# EAGLE design drive_board (EAGLE 8.4.0)
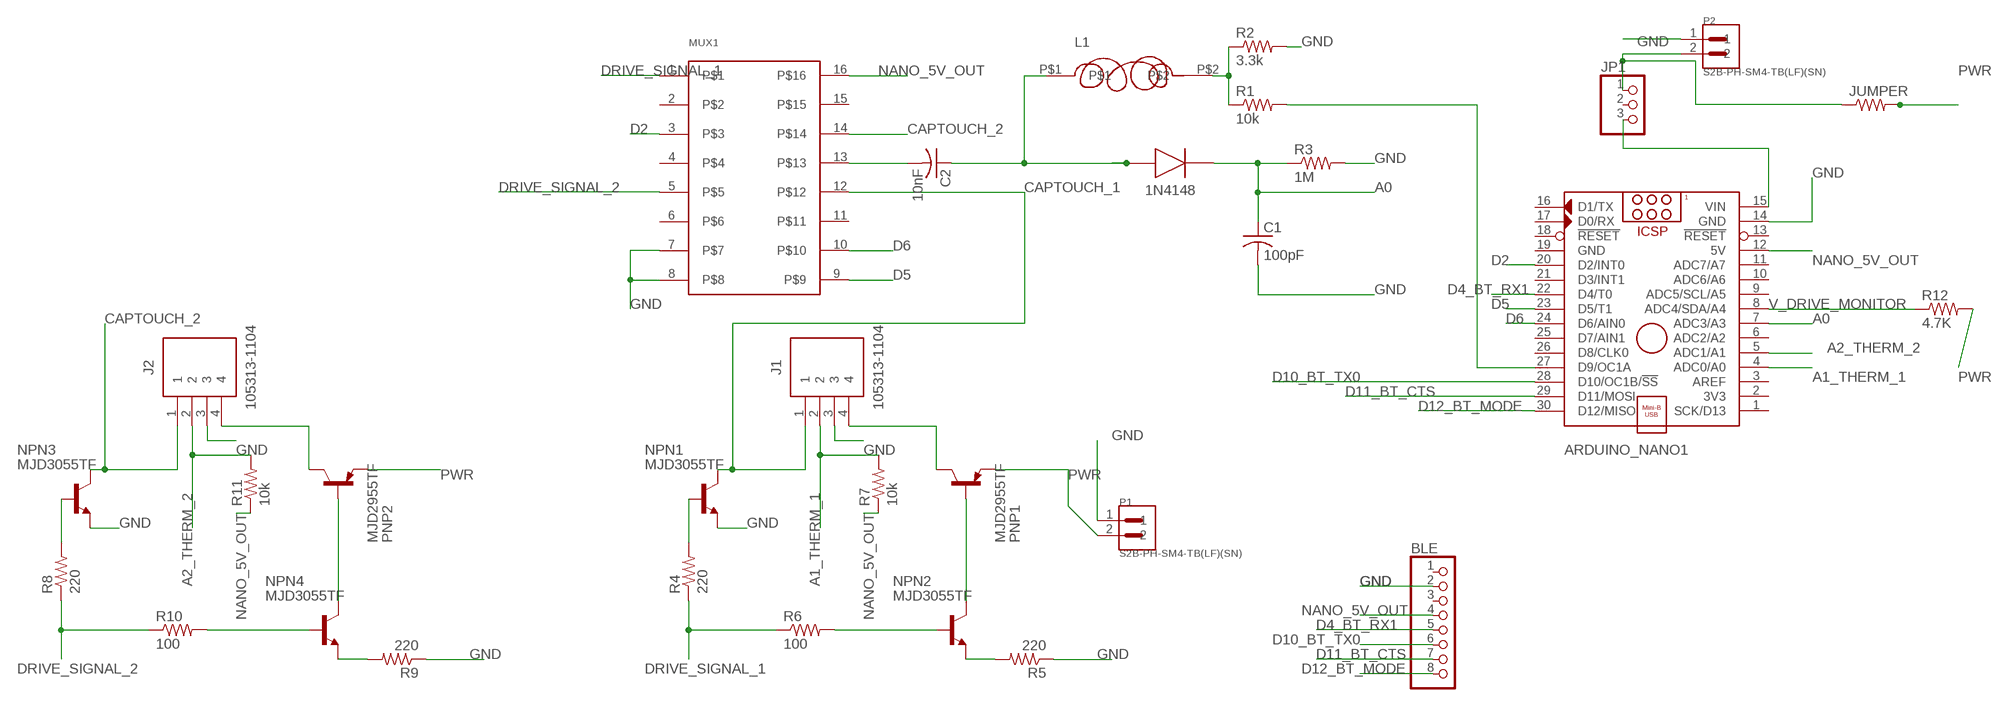
[diagram p0: schematic, sheet 1]

## Parts
1N4148  1N5819HW-7-F  [SOD3716X145N]
ARDUINO_NANO1  ARDUINO_NANO  [ARDUINO_NANO]
BLE  PINHD-1X8  [1X08]
C1  100pF  C-USC0805  [C0805]
C2  10nF  C-USC0805  [C0805]
J1  105313-1104  [105313-1104]
J2  105313-1104  [105313-1104]
JP1  PINHD-1X3  [1X03]
JUMPER  R-US_R0805  [R0805]
L1  SRE6603  [SRE6603]
MUX1  HAIRIO_MUX  [SO16]
NPN1  MJD3055TF  MJD31  [DPAK]
NPN2  MJD3055TF  MJD31  [DPAK]
NPN3  MJD3055TF  MJD31  [DPAK]
NPN4  MJD3055TF  MJD31  [DPAK]
P1  S2B-PH-SM4-TB(LF)(SN)  [JST_S2B-PH-SM4-TB(LF)(SN)]
P2  S2B-PH-SM4-TB(LF)(SN)  [JST_S2B-PH-SM4-TB(LF)(SN)]
PNP1  MJD2955TF  MJD32  [DPAK]
PNP2  MJD2955TF  MJD32  [DPAK]
R1  10k  R-US_R0805  [R0805]
R2  3.3k  R-US_R0805  [R0805]
R3  1M  R-US_R0805  [R0805]
R4  220  R-US_R0805  [R0805]
R5  220  R-US_R0805  [R0805]
R6  100  R-US_R0805  [R0805]
R7  10k  R-US_R0805  [R0805]
R8  220  R-US_R0805  [R0805]
R9  220  R-US_R0805  [R0805]
R10  100  R-US_R0805  [R0805]
R11  10k  R-US_R0805  [R0805]
R12  4.7K  R-US_R0805  [R0805]

## Nets
A0: 1N4148.1(K) ARDUINO_NANO1.7(ADC3/A3) C1.1 R3.1
A1_THERM_1 [isolation]: ARDUINO_NANO1.4(ADC0/A0) J1.2 R7.2
A2_THERM_2: ARDUINO_NANO1.5(ADC1/A1) J2.2 R11.2
CAPTOUCH_1 [isolation]: J1.1 MUX1.12 NPN1.4(C)
CAPTOUCH_2: J2.1 MUX1.14 NPN3.4(C)
D2: ARDUINO_NANO1.20(D2/INT0) MUX1.3
D4_BT_RX1: ARDUINO_NANO1.22(D4/T0) BLE.5
D5: ARDUINO_NANO1.23(D5/T1) MUX1.9
D6: ARDUINO_NANO1.24(D6/AIN0) MUX1.10
D10_BT_TX0: ARDUINO_NANO1.28(D10/OC1B/!SS) BLE.6
D11_BT_CTS: ARDUINO_NANO1.29(D11/MOSI) BLE.7
D12_BT_MODE: ARDUINO_NANO1.30(D12/MISO) BLE.8
DRIVE_SIGNAL_1 [isolation]: MUX1.1 R4.1 R6.1
DRIVE_SIGNAL_2: MUX1.5 R8.1 R10.1
GND: ARDUINO_NANO1.14(GND) BLE.2 C1.2 J1.3 J2.3 MUX1.7 MUX1.8 NPN1.3(E) NPN3.3(E) P1.1 P2.1 R2.2 R3.2 R5.1 R9.1
N$1: NPN2.1(B) R6.2
N$2: NPN2.3(E) R5.2
N$3: NPN4.1(B) R10.2
N$4: NPN2.4(C) PNP1.1(B)
N$5: NPN1.1(B) R4.2
N$6: C2.2 MUX1.13
N$7: 1N4148.2(A) C2.1 L1.P$1
N$8: J1.4 PNP1.4(C)
N$9: ARDUINO_NANO1.27(D9/OC1A) R1.2
N$10: L1.P$2 R1.1 R2.1
N$11: NPN4.3(E) R9.2
N$12: ARDUINO_NANO1.15(VIN) JP1.3
N$13: NPN4.4(C) PNP2.1(B)
N$14: NPN3.1(B) R8.2
N$15: J2.4 PNP2.4(C)
N$16: JP1.1 JUMPER.1 P2.2
NANO_5V_OUT: ARDUINO_NANO1.12(5V) BLE.4 MUX1.16 R7.1 R11.1
PWR: JUMPER.2 P1.2 PNP1.3(E) PNP2.3(E) R12.2
V_DRIVE_MONITOR: ARDUINO_NANO1.8(ADC4/SDA/A4) R12.1
Unconnected: ARDUINO_NANO1.1(SCK/D13) ARDUINO_NANO1.2(3V3) ARDUINO_NANO1.3(AREF) ARDUINO_NANO1.6(ADC2/A2) ARDUINO_NANO1.9(ADC5/SCL/A5) ARDUINO_NANO1.10(ADC6/A6) ARDUINO_NANO1.11(ADC7/A7) ARDUINO_NANO1.13(!RESET) ARDUINO_NANO1.16(D1/TX) ARDUINO_NANO1.17(D0/RX) ARDUINO_NANO1.18(!RESET) ARDUINO_NANO1.21(D3/INT1) ARDUINO_NANO1.25(D7/AIN1) ARDUINO_NANO1.26(D8/CLK0) BLE.1 BLE.3 JP1.2 MUX1.2 MUX1.4 MUX1.6 MUX1.11 MUX1.15

## Power pins joined to a net without a drawn wire
GND: ARDUINO_NANO1.19(GND)

## Library data of the parts
1N4148 = hairiodiode:1N5819HW-7-F: Diode Schottky 1A 40V SOD123 Diodes Inc 1N5819HW-7-F, SMT Schottky Diode, 40V 1A, 2-Pin SOD-123 <https://componentsearchengine.com/Images/3/1N5819HW-7-F.jpg> Source: Datasheet <http://www.diodes.com/_files/datasheets/ds30217.pdf>; ALLIED_NUMBER: 70437201; DESCRIPTION: Diode Schottky 1A 40V SOD123 Diodes Inc 1N5819HW-7-F, SMT Schottky Diode, 40V 1A, 2-Pin SOD-123; HEIGHT: 1.45mm; MANUFACTURER_NAME: Diodes Inc.; MANUFACTURER_PART_NUMBER: 1N5819HW-7-F; RS_PART_NUMBER: 9227964; SUPPLIER_NAME: RS
ARDUINO_NANO1 = ArduinoNanoV30:ARDUINO_NANO: Arduino Nano V3.0 Module Overview: The Arduino Nano is a small, complete, and breadboard-friendly board based on the ATmega328 (Arduino Nano 3.x) or ATmega168 (Arduino Nano 2.x). It has more or less the same functionality of the Arduino Duemilanove, but in a different package. It lacks only a DC power jack, and works with a Mini-B USB cable instead of a standard one. The Nano was designed and is being produced by Gravitech <http://www.gravitech.us/arna30wiatp.html>. General specifications: Item Value Microcontroller Atmel ATmega168 or ATmega328 Operating Voltage (logic level) 5 V Input Voltage (recommended) 7-12 V Input Voltage (limits) 6-20 V Digital I/O Pins 14 (of which 6 provide PWM output) Analog Input Pins 8 DC Current per I/O Pin 40 mA Flash Memory 16 KB (ATmega168) or 32 KB (ATmega328) of which 2 KB used by bootloader SRAM 1 KB (ATmega168) or 2 KB (ATmega328) EEPROM 512 bytes (ATmega168) or 1 KB (ATmega328) Clock Speed 16 MHz Dimensions (Inches) 0.73" x 1.70" Dimensions (mm) 18mm x 45mm Overall height About 9 mm (not including pins) Weigth 5 g Power: The Arduino Nano can be powered via the Mini-B USB connection, 6-20V unregulated external power supply (pin 30), or 5V regulated external power supply (pin 27). The power source is automatically selected to the highest voltage source. Memory: The ATmega168 has 16 KB of flash memory for storing code (of which 2 KB is used for the bootloader); the ATmega328 has 32 KB, (also with 2 KB used for the bootloader). The ATmega168 has 1 KB of SRAM and 512 bytes of EEPROM (which can be read and written with the EEPROM library); the ATmega328 has 2 KB of SRAM and 1 KB of EEPROM. Input and Output: Each of the 14 digital pins on the Nano can be used as an input or output, using pinMode(), digitalWrite(), and digitalRead() functions. They operate at 5 volts. Each pin can provide or receive a maximum of 40 mA and has an internal pull-up resistor (disconnected by default) of 20-50 kOhms. In addition, some pins have specialized functions. Visit Arduino - ArduinoBoardNano <https://www.arduino.cc/en/Main/ArduinoBoardNano>
BLE = pinhead:PINHD-1X8: PIN HEADER
C1 C2 = resistor:C-US: CAPACITOR, American symbol
J1 J2 = 105313-1104:105313-1104: Headers & Wire Housings NanoFit RA Hdr TH SR 4Ckt Tin Blk <https://componentsearchengine.com/Images/1/105313-1104.jpg> Source: Datasheet <http://www.molex.com/webdocs/datasheets/pdf/en-us//1053131104_PCB_HEADERS.pdf>; DESCRIPTION: Headers & Wire Housings NanoFit RA Hdr TH SR 4Ckt Tin Blk; HEIGHT: mm; MANUFACTURER_NAME: Molex; MANUFACTURER_PART_NUMBER: 105313-1104; SUPPLIER_NAME: RS
JP1 = pinhead:PINHD-1X3: PIN HEADER
JUMPER R1-R12 = resistor:R-US_: RESISTOR, American symbol
L1 = HairIO:SRE6603: SRE6603 - Shielded SMD Power Inductor Technical Specifications: Test Voltage: 0.1V Operating Temperature: -25°C to 105°C Digikey: SRE6603-103MCT-ND Mouser: 652-SRE6603-103M
MUX1 = 40xx:HAIRIO_MUX
NPN1-NPN4 = transistor:MJD31*: Complementary Power Transistors
P1 P2 = S2B-PH-SM4-TB_LF__SN_:S2B-PH-SM4-TB(LF)(SN): CONN HEADER PH SIDE 2POS 2MM SMD; AVAILABILITY: Good; DESCRIPTION: CONN HEADER PH SIDE 2POS 2MM SMD; MF: JST; MP: S2B-PH-SM4-TB(LF)(SN); PACKAGE: FakePackage u; PRICE: 0.34 USD
PNP1 PNP2 = transistor:MJD32*: Complementary Power Transistors

## Board
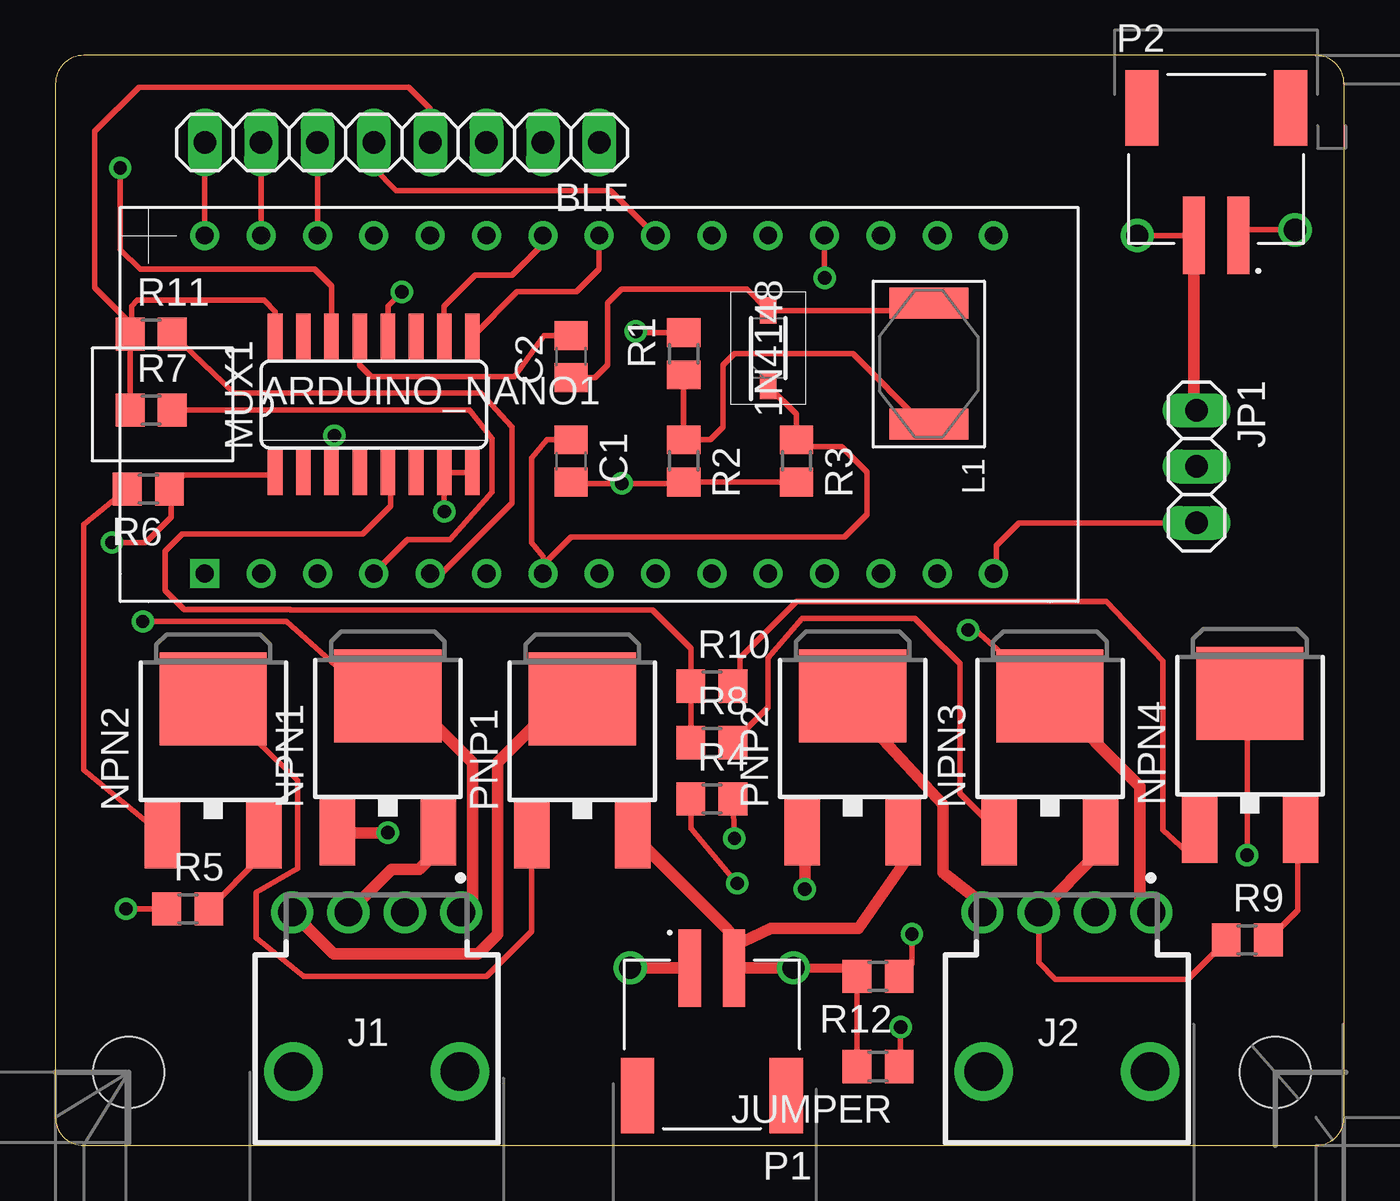
[diagram p1: board, top side]
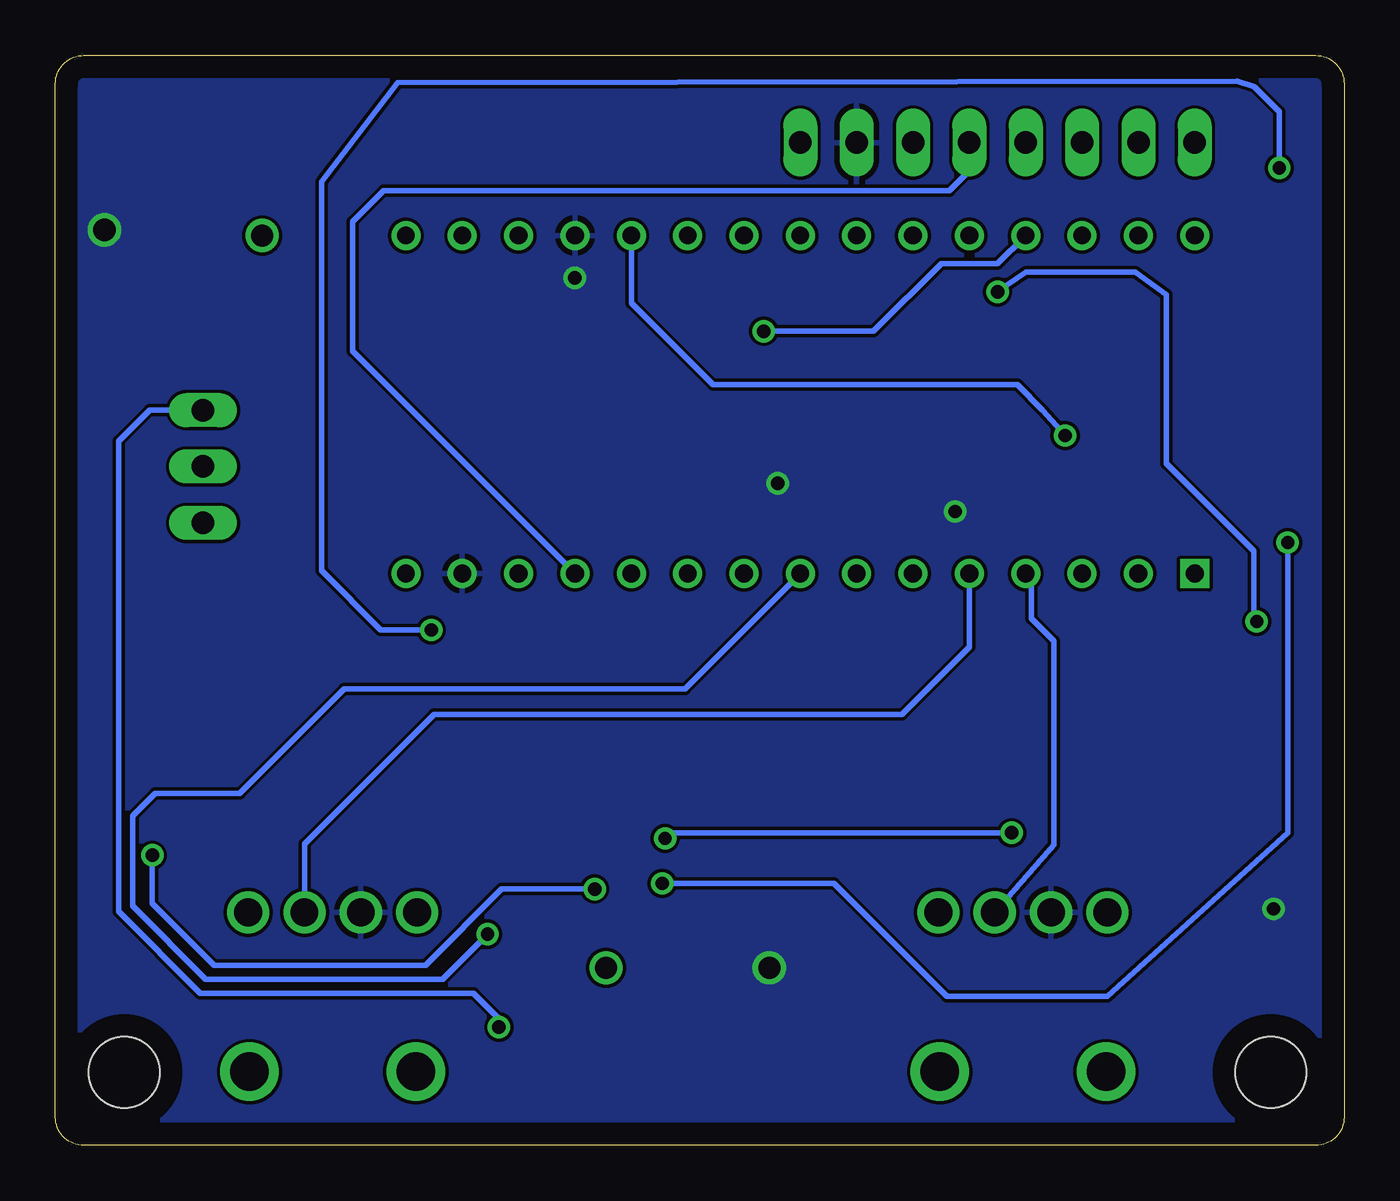
[diagram p2: board, bottom side, seen from below]

Size 58.09 x 49.14 mm. Coordinates in mm from the lower left corner, seen from the top.
Outline: 0,47.87 0,3.3 0,1.27 arc90 1.27,0 54.99,0 56.82,0 arc90 58.09,1.27 58.09,47.87 arc90 56.82,49.14 1.27,49.14 arc90 0,47.87
Copper layers (1*16): Top 0.035mm / dielectric 1.5mm / Bottom 0.035mm
Design rules "default": minimum track width 6mil, minimum drill 0.35mm, track to track 6mil, track to pad 6mil, pad to pad 6mil, via to via 6mil, smd to smd 6mil, copper to edge 40mil, drill to drill 6mil, minimum pad ring 10mil, minimum via ring 8mil, stop-mask expansion 4mil, vias tented up to drill 0mil, thermal gap 10mil
Holes 3.2 mm at 3.3,3.3 54.99,3.3

### Footprints (pad centres in the part's own frame; a part is rotated, then mirrored left to right if it is on the bottom)
SOD3716X145N = smd 1.2 x 0.75: 1 -1.7,0; 2 1.7,0
ARDUINO_NANO = drill 0.8 square: 1 -20.32,-7.62 | drill 0.8: 2 -17.78,-7.62; 3 -15.24,-7.62; 4 -12.7,-7.62; 5 -10.16,-7.62; 6 -7.62,-7.62; 7 -5.08,-7.62; 8 -2.54,-7.62; 9 0,-7.62; 10 2.54,-7.62; 11 5.08,-7.62; 12 7.62,-7.62; 13 10.16,-7.62; 14 12.7,-7.62; 15 15.24,-7.62; 16 15.24,7.62; 17 12.7,7.62; 18 10.16,7.62; 19 7.62,7.62; 20 5.08,7.62; 21 2.54,7.62; 22 0,7.62; 23 -2.54,7.62; 24 -5.08,7.62; 25 -7.62,7.62; 26 -10.16,7.62; 27 -12.7,7.62; 28 -15.24,7.62; 29 -17.78,7.62; 30 -20.32,7.62
1X08 = drill 1.016 long: 1 -8.89,0; 2 -6.35,0; 3 -3.81,0; 4 -1.27,0; 5 1.27,0; 6 3.81,0; 7 6.35,0; 8 8.89,0
C0805 = smd 1.3 x 1.5: 1 -0.95,0; 2 0.95,0
105313-1104 = drill 1.25 pad 1.9: 1 3.81,10.38; 2 1.27,10.38; 3 -1.27,10.38; 4 -3.81,10.38 | drill 1.75 pad 1.75: 5 3.75,3.2; 6 -3.75,3.2
1X03 = drill 1.016 long: 1 -2.54,0; 2 0,0; 3 2.54,0
R0805 = smd 1.3 x 1.5: 1 -0.95,0; 2 0.95,0
SRE6603 = smd 1.4 x 3.56: P$1 0,0; P$2 5.46,0
SO16 = smd 0.66 x 2.032: 1 -4.445,-3.073; 2 -3.175,-3.073; 3 -1.905,-3.073; 4 -0.635,-3.073; 5 0.635,-3.073; 6 1.905,-3.073; 7 3.175,-3.073; 8 4.445,-3.073; 9 4.445,3.073; 10 3.175,3.073; 11 1.905,3.073; 12 0.635,3.073; 13 -0.635,3.073; 14 -1.905,3.073; 15 -3.175,3.073; 16 -4.445,3.073
DPAK = smd 1.6 x 3: 1 -2.28,-4.04; 3 2.28,-4.04 | smd 4.826 x 4.191: 4 0,2.096
JST_S2B-PH-SM4-TB(LF)(SN) = smd 1 x 3.5: 1 1,0; 2 -1,0 | smd 1.5 x 3.4: P1 3.35,5.75; P2 -3.35,5.75

### Placement (x,y rotation side)
1N4148  32.13,35.94 90 top
ARDUINO_NANO1  27.05,33.4 0 top
BLE  15.62,45.21 180 top
C1  23.24,30.86 270 top
C2  23.24,35.56 90 top
J1  14.48,0.13 0 top
J2  45.59,0.13 0 top
JP1  51.43,30.61 270 top
JUMPER  37.08,3.56 180 top
L1  39.37,37.97 270 top
MUX1  14.35,33.4 0 top
NPN1  14.99,18.16 0 top
NPN2  7.11,18.03 0 top
NPN3  44.83,18.16 0 top
NPN4  53.85,18.29 0 top
P1  29.59,8 180 top
P2  52.32,41.02 0 top
PNP1  23.75,18.03 0 top
PNP2  35.94,18.16 0 top
R1  28.32,35.69 90 top
R2  28.32,30.86 270 top
R3  33.4,30.86 270 top
R4  29.59,15.62 0 top
R5  5.97,10.67 0 top
R6  4.19,29.59 180 top
R7  4.32,33.15 0 top
R8  29.59,18.16 0 top
R9  53.72,9.27 0 top
R10  29.59,20.7 0 top
R11  4.32,36.58 0 top
R12  37.08,7.62 180 top

### Tracks (layer width: path | path; a pad name or v marks a point on that pad's centre or on a via)
A0
  Top 0.254: 1N4148.1 33.4,32.97 R3.1 33.72,31.5 35.43,31.5 36.58,30.35 36.58,28.45 35.56,27.43 23.24,27.43 21.97,26.16 ARDUINO_NANO1.7 21.97,26.54 21.46,27.18 21.46,30.99 22.16,31.81 C1.1 | 23.49,31.81 C1.1 | 23.24,31.71 C1.1
A1_THERM_1
  Top 0.254: R7.2 18.67,33.15 19.69,31.88 19.69,29.46 17.78,27.3 15.88,27.3 ARDUINO_NANO1.4
  Bottom 0.254: J1.2 13.08,13.55 13.08,22.73 14.1,23.75 14.1,25.53 ARDUINO_NANO1.4
A2_THERM_2
  Top 0.254: R11.2 8.06,33.91 19.18,33.91 20.57,32.39 20.57,28.96 17.4,25.78 ARDUINO_NANO1.5
  Bottom 0.254: J2.2 46.86,13.59 41.02,19.43 19.94,19.43 16.89,22.48 ARDUINO_NANO1.5
CAPTOUCH_1  (via drill 0.6)
  Top 0.254: MUX1.12 14.99,37.85 v15.62,38.48 | 18.38,10.76 J1.1 | v3.94,23.62 10.41,23.62 14.16,20.26 NPN1.4
  Top 0.508: J1.1 18.8,11.01 18.8,17.27 15.81,20.26 NPN1.4
  Bottom 0.254: v15.62,38.48 14.35,39.37 9.4,39.37 8,38.35 8,30.73 4.06,26.8 4.06,23.88 v3.94,23.62
CAPTOUCH_2  (via drill 0.6)
  Top 0.254: MUX1.14 12.45,38.73 11.68,39.5 3.81,39.5 2.92,40.39 v2.92,44.07 | NPN3.4 41.47,23.24 v41.15,23.24
  Top 0.508: NPN3.4 48.9,16.19 48.9,11.01 J2.1
  Bottom 0.254: v2.92,44.07 2.92,46.61 4.05,47.73 4.81,47.99 42.67,47.91 46.1,43.46 46.1,26.8 | 46.1,26.8 46.1,25.91 | v41.15,23.24 43.43,23.24 46.1,25.91 | 46.1,25.91 46.1,26.8
D2  (via drill 0.6)
  Top 0.254: MUX1.3 12.57,30.46 v12.57,32
  Bottom 0.254: ARDUINO_NANO1.20 32.13,37.97 28.45,34.29 14.73,34.29 13.59,33.15 v12.57,32
D4_BT_RX1
  Top 0.254: BLE.5 14.35,44.07 15.37,43.05 25.02,43.05 ARDUINO_NANO1.22
D5
  Top 0.254: MUX1.9 20.8,38.48 23.49,38.48 24.51,39.5 ARDUINO_NANO1.23
D6
  Top 0.254: 17.53,36.95 MUX1.10 | MUX1.10 17.53,36.96 | MUX1.10 17.53,37.85 18.92,39.24 20.57,39.24 21.97,40.64 ARDUINO_NANO1.24
D10_BT_TX0
  Top 0.254: BLE.6 ARDUINO_NANO1.28
D11_BT_CTS
  Top 0.254: BLE.7 ARDUINO_NANO1.29
D12_BT_MODE
  Top 0.254: BLE.8 ARDUINO_NANO1.30
DRIVE_SIGNAL_1  (via drill 0.6)
  Top 0.152: 9.91,30.23 MUX1.1
  Top 0.254: R4.1 28.64,14.29 v30.73,11.81 | 9.91,30.23 5.78,30.23 R6.1 5.21,29.53 5.21,28.32 4.06,27.18 v2.54,27.18
  Bottom 0.254: v2.54,27.18 2.54,14.1 10.67,6.73 17.91,6.73 22.99,11.81 v30.73,11.81
DRIVE_SIGNAL_2
  Top 0.254: R8.1 R10.1 28.64,22.41 26.92,24.13 10.61,24.13 10.58,24.15 10.58,24.16 5.81,24.16 4.95,25.02 4.95,26.8 5.71,27.56 13.84,27.56 15.11,28.83 15.11,29.59 14.99,29.72 MUX1.5
GND  (via drill 0.6, 1)
  Top 0.254: v34.67,39.12 ARDUINO_NANO1.19 | R3.2 R2.2 28.32,29.85 v25.53,29.85 23.24,29.85 C1.2 | MUX1.8 MUX1.7 v17.53,28.57 | 52.45,9.27 R9.1 52.77,9.21 51.05,7.49 45.09,7.49 44.32,8.25 J2.3 | R5.1 v3.17,10.67 | P2.1 53.58,41.28 v55.88,41.28
  Top 0.508: P1.1 v25.91,8 | NPN3.3 47.11,13.29 J2.3 | J1.3 15.15,12.45 16.38,12.45 17.27,13.33 NPN1.3
  pour Bottom: 58.29,49.02 58.17,0.25 58.55,0 -0.13,-0.25 -0.38,48.89
N$1
  Top 0.254: NPN2.1 1.27,16.92 1.27,28 R6.2
N$2
  Top 0.254: NPN2.3 9.27,13.86 9.27,13.72 | 9.27,13.72 9.27,13.08 | R5.2 9.27,13.02 9.27,13.72
N$3
  Top 0.254: R10.2 30.86,21.02 30.86,21.97 33.4,24.51 47.37,24.51 49.91,21.84 49.91,14.22 51.18,13.08 51.18,14 NPN4.1
N$4
  Top 0.254: NPN2.4 10.92,16.45 10.92,12.5 9.06,11.4 9.06,9.36 11.18,7.62 19.43,7.62 21.46,9.65 21.46,13.72 21.35,13.83 | 21.35,13.83 20.96,13.34 | 21.35,13.83 PNP1.1
N$5  (via drill 0.6)
  Top 0.254: 15.11,14.1 15.09,14.12 15.06,14.1 v14.99,14.1 14.99,14.12 | 30.86,15.3 R4.2 v30.61,13.84
  Top 0.508: v14.99,14.1 12.73,14.1 NPN1.1
  Bottom 0.254: v30.61,13.84 30.35,14.1 v14.99,14.1
N$6
  Top 0.254: MUX1.13 13.72,35.18 14.22,34.67 20.7,34.67 22.03,36.51 C2.2
N$7
  Top 0.254: L1.P$1 39.04,37.64 1N4148.2 31.16,38.61 25.53,38.61 24.89,37.97 24.89,35.18 24.32,34.61 C2.1
N$8
  Top 0.508: J1.4 12.54,8.64 19.05,8.64 19.94,9.53 19.94,17.27 22.87,20.2 23.14,20.2 | 23.14,20.2 22.67,20.26 | 23.14,20.2 PNP1.4
N$9  (via drill 0.6)
  Top 0.254: R1.2 26.35,36.64 v26.16,36.7
  Bottom 0.254: ARDUINO_NANO1.27 15.62,39.75 18.16,39.75 21.21,36.7 v26.16,36.7
N$10
  Top 0.254: R1.1 R2.1 29.52,31.81 30.1,32.39 30.1,35.18 30.61,35.69 35.94,35.69 39.12,32.51 L1.P$2
N$11
  Top 0.254: NPN4.3 56,13.23 56,10.6 R9.2
N$12
  Top 0.254: ARDUINO_NANO1.15 42.42,25.91 42.42,27.05 43.43,28.07 JP1.3
N$13  (via drill 0.6)
  Top 0.254: 53.58,20.29 NPN4.4 | 53.58,20.29 54.23,20.38 | v53.72,13.08 53.72,20.15 53.58,20.29
  Top 0.508: v33.78,11.56 33.78,13.08 33.66,13.2 PNP2.1
  Bottom 0.254: v33.78,11.56 37.97,11.56 41.4,8.13 50.93,8.13 53.72,10.92 v53.72,13.08
N$14
  Top 0.152: 40.16,22.33 40.01,22.48 40.45,22.03 | NPN3.1 42.3,14.37 42.3,14.39
  Top 0.254: R8.2 32.13,19.75 32.13,21.97 33.66,23.75 38.73,23.75 40.01,22.48 | 40.07,22.41 40.45,22.03 40.77,21.72 40.77,15.87 42.29,14.35 42.3,14.39 42.42,14.73
N$15
  Top 0.254: 35.94,20.7 PNP2.4 35.88,20.26 35.69,20.07 35.43,19.81 35.81,19.81
  Top 0.508: J2.4 41.78,10.92 40.01,12.32 40.01,15.37 35.69,20.07
N$16  (via drill 0.6, 1)
  Top 0.152: 50.42,41.02 P2.2 51.32,40.77
  Top 0.254: 51.37,33.21 JP1.1 | v48.77,41.02 50.42,41.02 51.31,41.02 | JUMPER.1 38.1,4.13 v38.1,5.33
  Top 0.508: 51.32,40.77 51.32,33.26 51.37,33.21
  Bottom 0.254: JP1.1 53.85,33.15 55.24,31.75 55.24,10.54 51.56,6.86 39.24,6.86 38.1,5.71 v38.1,5.33
NANO_5V_OUT
  Top 0.254: BLE.4 16.89,46.74 15.92,47.71 3.77,47.71 1.78,45.72 1.78,38.67 3.34,37.12 3.34,36.61 | R7.1 R11.1 | R11.1 3.34,36.61 | 3.34,36.61 3.24,36.07 | R11.1 3.43,36.64 3.43,37.85 3.68,38.1 9.4,38.1 9.91,37.59 MUX1.16
  Bottom 0.254: BLE.4 16.89,43.94 17.78,43.05 43.31,43.05 44.7,41.66 44.7,35.81 ARDUINO_NANO1.12
PWR  (via drill 1)
  Top 0.254: 35.88,7.37 R12.2 JUMPER.2
  Top 0.406: v33.27,8 35.75,8 R12.2
  Top 0.508: 38.48,13.86 PNP2.3 38.22,12.69 36.2,9.78 32.26,9.78 30.59,9 | PNP1.3 30.29,9.74 arc-45 30.59,9 | v33.27,8 P1.2 30.59,9
V_DRIVE_MONITOR  (via drill 0.6)
  Top 0.254: 38.48,7.17 R12.1 38.61,8.19 v38.61,9.53
  Bottom 0.254: ARDUINO_NANO1.8 29.72,20.57 45.09,20.57 49.78,15.87 53.59,15.87 54.61,14.86 54.61,10.79 51.31,7.49 40.64,7.49 v38.61,9.53